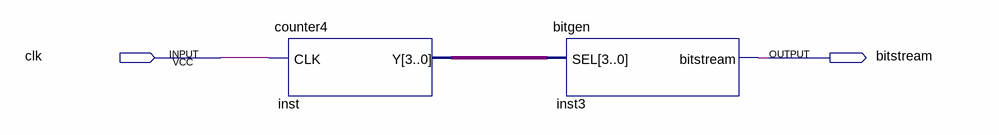
[diagram p0: schematic sheet]
// Quartus schematic test.bdf as structural Verilog: 2 symbols, 2 pins
module test (
  input  clk,
  output bitstream
);

  wire [3:0] inst_y;

  counter4 inst (.CLK(clk), .Y(inst_y));
  bitgen inst3 (.SEL(inst_y), .bitstream(bitstream));
endmodule
